# Altium schematic sheet Ctrl.SchDoc
size A4
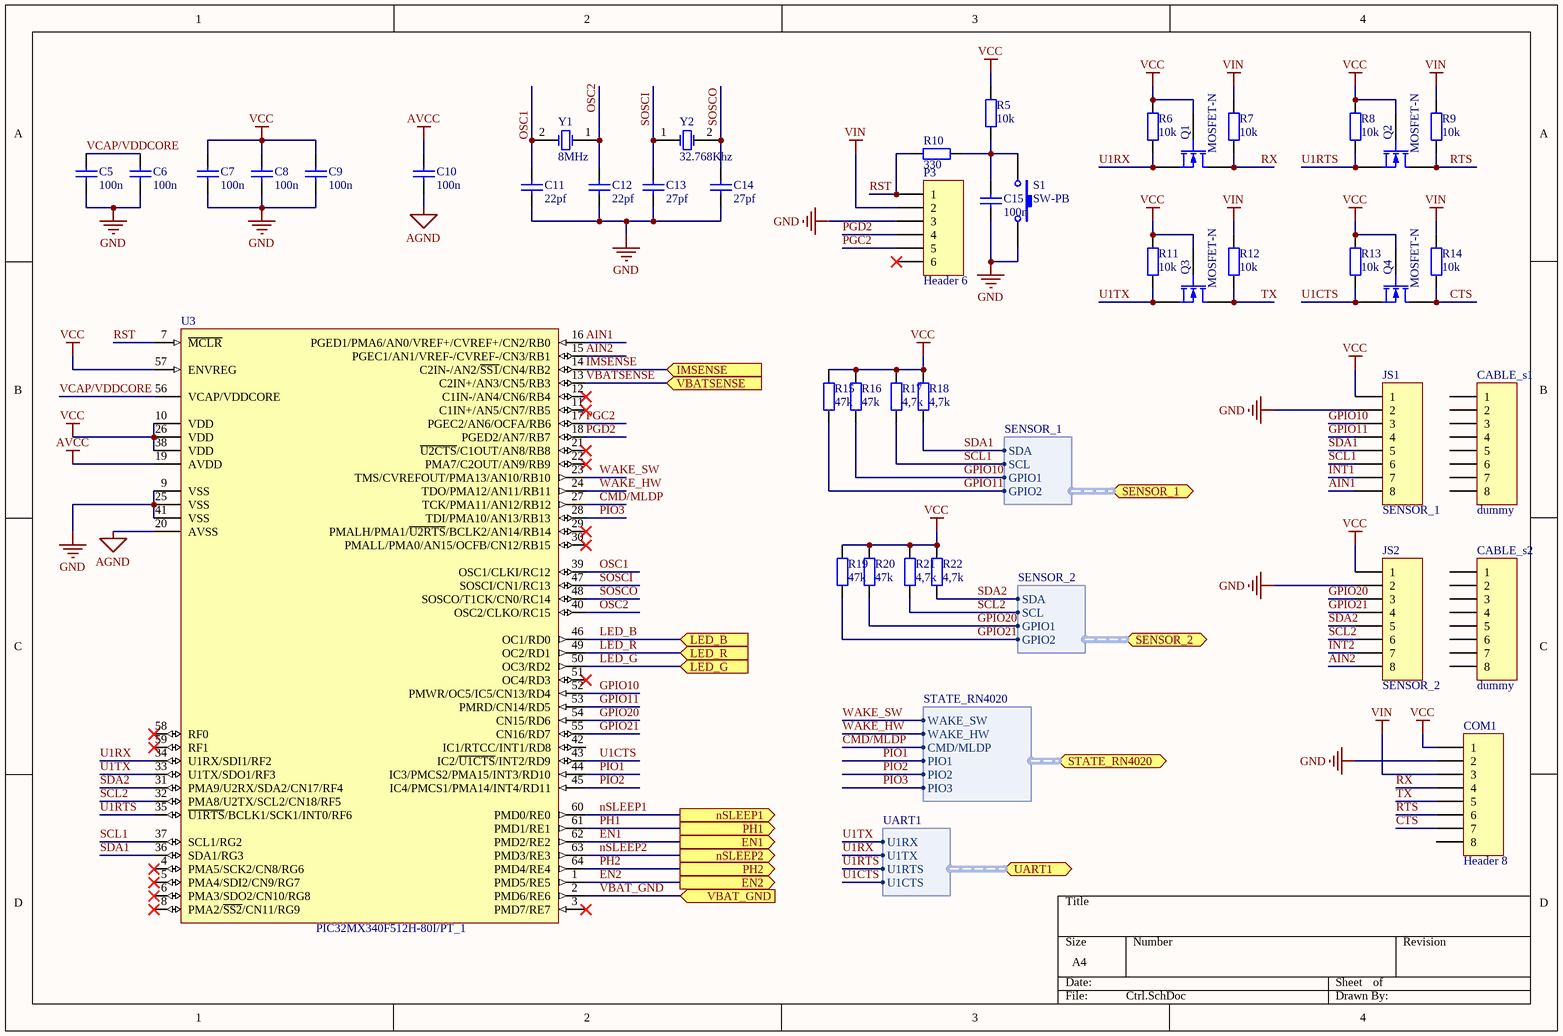
[diagram p0: Ctrl.SchDoc]

## Parts
C5  100n  [RES 0603/1608]
C6  100n  [RES 0603/1608]
C7  100n  [RES 0603/1608]
C8  100n  [RES 0603/1608]
C9  100n  [RES 0603/1608]
C10  100n  [RES 0603/1608]
C11  22pf  [RES 0603/1608]
C12  22pf  [RES 0603/1608]
C13  27pf  [RES 0603/1608]
C14  27pf  [RES 0603/1608]
C15  100n  [RES 0603/1608]
CABLE_s1  dummy
CABLE_s2  dummy
COM1  Header 8  [7-215460-8]
JS1  SENSOR_1  [7-215460-8]
JS2  SENSOR_2  [7-215460-8]
P3  Header 6  [HDR1X6]
Q1  MOSFET-N  [SOT-23]
Q2  MOSFET-N  [SOT-23]
Q3  MOSFET-N  [SOT-23]
Q4  MOSFET-N  [SOT-23]
R5  10k  [RES 0603/1608]
R6  10k  [RES 0603/1608]
R7  10k  [RES 0603/1608]
R8  10k  [RES 0603/1608]
R9  10k  [RES 0603/1608]
R10  330  [RES 0603/1608]
R11  10k  [RES 0603/1608]
R12  10k  [RES 0603/1608]
R13  10k  [RES 0603/1608]
R14  10k  [RES 0603/1608]
R15  47k  [RES 0603/1608]
R16  47k  [RES 0603/1608]
R17  4,7k  [RES 0603/1608]
R18  4,7k  [RES 0603/1608]
R19  47k  [RES 0603/1608]
R20  47k  [RES 0603/1608]
R21  4,7k  [RES 0603/1608]
R22  4,7k  [RES 0603/1608]
S1  SW-PB  [Button]
U3  PIC32MX340F512H-80I/PT_1  [TSQFP50P1200X1200X120-64N]
Y1  8MHz  [XTAL_HC-49/SM]
Y2  32.768Khz  [XTAL_AB26T]

## Ports
EN1 (out), EN2 (out), IMSENSE (in), LED_B (in), LED_G (in), LED_R (in), nSLEEP1 (out), nSLEEP2 (out), PH1 (out), PH2 (out), SENSOR_1 (harness SENSOR_1), SENSOR_2 (harness SENSOR_2), STATE_RN4020 (harness STATE_RN4020), UART1 (harness UART1), VBAT_GND (in), VBATSENSE (in)

## Harnesses
SENSOR_1: SDA, SCL, GPIO1, GPIO2
SENSOR_2: SDA, SCL, GPIO1, GPIO2
STATE_RN4020: WAKE_SW, CMD/MLDP, WAKE_HW, PIO1, PIO3, PIO2
UART1: U1RX, U1TX, U1RTS, U1CTS

## Nets
AGND: C10.2 U3.20(AVSS)
AVCC: C10.1 U3.19(AVDD)
GND: C5.2 C6.2 C7.2 C8.2 C9.2 C11.2 C12.2 C13.2 C14.2 C15.2 COM1.2 JS1.2 JS2.2 P3.3 S1.2 U3.9(VSS) U3.25(VSS) U3.41(VSS)
VCC: C7.1 C8.1 C9.1 COM1.1 JS1.1 JS2.1 Q1.2(G) Q2.2(G) Q3.2(G) Q4.2(G) R5.2 R6.2 R8.2 R11.2 R13.2 R15.2 R16.2 R17.2 R18.2 R19.2 R20.2 R21.2 R22.2 U3.10(VDD) U3.26(VDD) U3.38(VDD) U3.57(ENVREG)
VIN: COM1.3 P3.2 R7.2 R9.2 R12.2 R14.2
AIN1: JS1.8 U3.16(PGED1/PMA6/AN0/VREF+/CVREF+/CN2/RB0)
AIN2: JS2.8 U3.15(PGEC1/AN1/VREF-/CVREF-/CN3/RB1)
CMD/MLDP: U3.27(TCK/PMA11/AN12/RB12) ; port STATE_RN4020.CMD/MLDP
CTS: COM1.7 Q4.1(D) R14.1
EN1: U3.62(PMD2/RE2) ; port EN1
EN2: U3.1(PMD5/RE5) ; port EN2
GPIO10: JS1.3 R16.1 U3.52(PMWR/OC5/IC5/CN13/RD4) ; port SENSOR_1.GPIO1
GPIO11: JS1.4 R15.1 U3.53(PMRD/CN14/RD5) ; port SENSOR_1.GPIO2
GPIO20: JS2.3 R20.1 U3.54(CN15/RD6) ; port SENSOR_2.GPIO1
GPIO21: JS2.4 R19.1 U3.55(CN16/RD7) ; port SENSOR_2.GPIO2
IMSENSE: U3.14(C2IN-/AN2/~{SS1}/CN4/RB2) ; port IMSENSE
INT1: JS1.7
INT2: JS2.7
LED_B: U3.46(OC1/RD0) ; port LED_B
LED_G: U3.50(OC3/RD2) ; port LED_G
LED_R: U3.49(OC2/RD1) ; port LED_R
nSLEEP1: U3.60(PMD0/RE0) ; port nSLEEP1
nSLEEP2: U3.63(PMD3/RE3) ; port nSLEEP2
OSC1: C11.1 U3.39(OSC1/CLKI/RC12) Y1.2(OSC2)
OSC2: C12.1 U3.40(OSC2/CLKO/RC15) Y1.1(OSC1)
PGC2: P3.5 U3.17(PGEC2/AN6/OCFA/RB6)
PGD2: P3.4 U3.18(PGED2/AN7/RB7)
PH1: U3.61(PMD1/RE1) ; port PH1
PH2: U3.64(PMD4/RE4) ; port PH2
PIO1: U3.44(IC3/PMCS2/PMA15/INT3/RD10) ; port STATE_RN4020.PIO1
PIO2: U3.45(IC4/PMCS1/PMA14/INT4/RD11) ; port STATE_RN4020.PIO2
PIO3: U3.28(TDI/PMA10/AN13/RB13) ; port STATE_RN4020.PIO3
RST: P3.1 R10.1 U3.7(~{MCLR})
RTS: COM1.6 Q2.1(D) R9.1
RX: COM1.4 Q1.1(D) R7.1
SCL1: JS1.6 R17.1 U3.37(SCL1/RG2) ; port SENSOR_1.SCL
SCL2: JS2.6 R21.1 U3.32(PMA8/U2TX/SCL2/CN18/RF5) ; port SENSOR_2.SCL
SDA1: JS1.5 R18.1 U3.36(SDA1/RG3) ; port SENSOR_1.SDA
SDA2: JS2.5 R22.1 U3.31(PMA9/U2RX/SDA2/CN17/RF4) ; port SENSOR_2.SDA
SOSCI: C13.1 U3.47(SOSCI/CN1/RC13) Y2.1(OSC1)
SOSCO: C14.1 U3.48(SOSCO/T1CK/CN0/RC14) Y2.2(OSC2)
TX: COM1.5 Q3.1(D) R12.1
U1CTS: Q4.3(S) R13.1 U3.43(IC2/~{U1CTS}/INT2/RD9) ; port UART1.U1CTS
U1RTS: Q2.3(S) R8.1 U3.35(~{U1RTS}/BCLK1/SCK1/INT0/RF6) ; port UART1.U1RTS
U1RX: Q1.3(S) R6.1 U3.34(U1RX/SDI1/RF2) ; port UART1.U1TX
U1TX: Q3.3(S) R11.1 U3.33(U1TX/SDO1/RF3) ; port UART1.U1RX
VBAT_GND: U3.2(PMD6/RE6) ; port VBAT_GND
VBATSENSE: U3.13(C2IN+/AN3/CN5/RB3) ; port VBATSENSE
VCAP/VDDCORE: C5.1 C6.1 U3.56(VCAP/VDDCORE)
WAKE_HW: U3.24(TDO/PMA12/AN11/RB11) ; port STATE_RN4020.WAKE_HW
WAKE_SW: U3.23(TMS/CVREFOUT/PMA13/AN10/RB10) ; port STATE_RN4020.WAKE_SW
NetC15_1: C15.1 R5.1 R10.2 S1.1

Not connected (* = marked no-connect by the designer): CABLE_s1 1 2 3 4 5 6 7 8; CABLE_s2 1 2 3 4 5 6 7 8; COM1 8; P3 6*; U3 3(PMD7/RE7)* 4(PMA5/SCK2/CN8/RG6)* 5(PMA4/SDI2/CN9/RG7)* 6(PMA3/SDO2/CN10/RG8)* 8(PMA2/~{SS2}/CN11/RG9)* 11(C1IN+/AN5/CN7/RB5)* 12(C1IN-/AN4/CN6/RB4)* 21(~{U2CTS}/C1OUT/AN8/RB8)* 22(PMA7/C2OUT/AN9/RB9)* 29(PMALH/PMA1/~{U2RTS}/BCLK2/AN14/RB14)* 30(PMALL/PMA0/AN15/OCFB/CN12/RB15)* 42(IC1/RTCC/INT1/RD8) 51(OC4/RD3)* 58(RF0)* 59(RF1)*

## Library data of the parts
C5-C10 C15 = Cap: MULTICOMP  MCSH21B104K100CT  Condensateur céramique multicouche CMS, 0805 [2012 Metric], 0.1 µF, 10 V, ± 10%, X7R, Série MCSH; Fournisseur: Farnell; RefFournisseur: 1856422; Fabricant: MULTICOMP; Footprint: 0603; RefFabricant: MCSH21B104K100CT; Value: 100n
C11 C12 = Cap: Condensateur céramique multicouche CMS, 0805 [2012 Metric], 22 pF, 50 V, ± 5%, C0G / NP0; Fabricant: WALSIN; Fournisseur: Farnell; RefFournisseur: 2497023; RefFabricant: 0805N220J500CT; Footprint: 0603; Value: 22pf
C13 C14 = Cap: Condensateur céramique multicouche CMS, 0805 [2012 Metric], 27 pF, 50 V, ± 5%, C0G / NP0; Fabricant: WALSIN; Fournisseur: Farnell; RefFournisseur: 2497027; RefFabricant: 0805N270J500CT; Footprint: 0603; Value: 27pf
CABLE_s1 CABLE_s2 = Header 8: AMP - TE CONNECTIVITY  1483352-2  Câble nappe, Fiche Micro-Match, Fiche Micro-Match, 8 Voies, 6 ", 150 mm, 1.27 mm; Fournisseur: Farnell; RefFournisseur: 1056214; Fabricant: AMP - TE CONNECTIVITY; RefFabricant: 1483352-2
COM1 JS1 JS2 = Header 8: AMP - TE CONNECTIVITY  7-215460-8  Connecteur carte-à-carte, Entrée latérale, 1.27 mm, 8 Contact(s), Embase, Série Micro-MaTch; Fournisseur: Farnell; RefFournisseur: 148751; RefFabricant: 7-215460-8; Fabricant: AMP - TE CONNECTIVITY
P3 = Header 6: Header, 6-Pin; Fournisseur: Farnell; RefFournisseur: 2356158; Fabricant: WURTH ELEKTRONIK; RefFabricant: 61300611121; Footprint: pin header 2.54mm
Q1-Q4 = MOSFET-N: Transistor MOSFET, Canal N, 200 mA, 60 V, 2.7 ohm, 10 V, 1.2 V; Fournisseur: Farnell; RefFournisseur: 2357125; Fabricant: NEXPERIA; RefFabricant: BSS138AKA
R5-R9 R11-R14 = Res2: Résistance à puce CMS, Couche épaisse, 10 kohm, 150 V, 0805; Fournisseur: Farnell; Fabricant: TE CONNECTIVITY; refFabricant: CRGH0805J10K; RefFournisseur: 2331808; Value: 10k; Footprint: 0603
R10 = Res2: ARCOL/OHMITE  ACPP0805330RBE  Résistance à puce CMS, Passivée de précision, 330 ohm, 100 V, 0805 [2012 Metric], 100 mW, ± 0.1%; Fournisseur: Farnell; RefFournisseur: 2504974; Value: 330; Fabricant: ARCOL/OHMITE; refFabricant: ACPP0805330RBE; Footprint: 0603
R15 R16 R19 R20 = Res2: Résistance à puce CMS, Couche épaisse, 47 kohm, 150 V, 0805 [2012 Metric], 125 mW, ± 1%, Série RC; Fournisseur: Farnell; Fabricant: YAGEO (PHYCOMP); refFabricant: RC0805FR-0747KL; RefFournisseur: 9237836; Value: 47k; Footprint: 0603
R17 R18 R21 R22 = Res2: Résistance à puce CMS, Couche épaisse, 4.7 kohm, 150 V, 0805 [2012 Metric], 125 mW, ± 5%, Série RC; Fournisseur: Farnell; Fabricant: YAGEO (PHYCOMP); refFabricant: RC0805JR-074K7L; RefFournisseur: 9234098; Value: 4,7k
  R17 R21 R22: Footprint: 0603
  R18: Footprint: 0805
S1 = SW-PB: Commutateur tactile, Non lumineux, 12 V, 50 mA, 100 gf, CMS, Série DTSZML-6; RefFournisseur: 2396053; RefFabricant: MC32882; Fabricant: MULTICOMP; Fournisseur: Farnell
U3 = PIC32MX340F512H-80I/PT_1: High Performance 80 MHz MIPS-Based 32-Bit Flash Microcontroller, 512KB Program Memory, 64-pin TQFP; Fournisseur: Farnell; Fabricant: Microchip; RefFournisseur: 1677915; RefFabricant: PIC32MX340F512H-80I/PT
Y1 = XTAL: MULTICOMP  HC49SM-8-30-50-60-16-ATF  Cristal, 8 MHz, CMS, 11.4mm x 4.65mm, 50 ppm, 16 pF, 30 ppm, Série HC49SM; Fournisseur: Farnell; RefFournisseur: 1667012; Fabricant: MULTICOMP; RefFabricant: HC49SM-8-30-50-60-16-ATF; value: 8MHz
Y2 = XTAL: ABRACON  AB26T-32.768KHZ  Cristal, 32.768 kHz, Cylindrique radial, diamètre 6.2mm x 2.1mm, 12.5 pF, 20 ppm, Série AB26T; Fournisseur: Farnell; RefFournisseur: 2467704; RefFabricant: AB26T-32.768KHZ; Fabricant: ABRACON; value: 32.768Khz